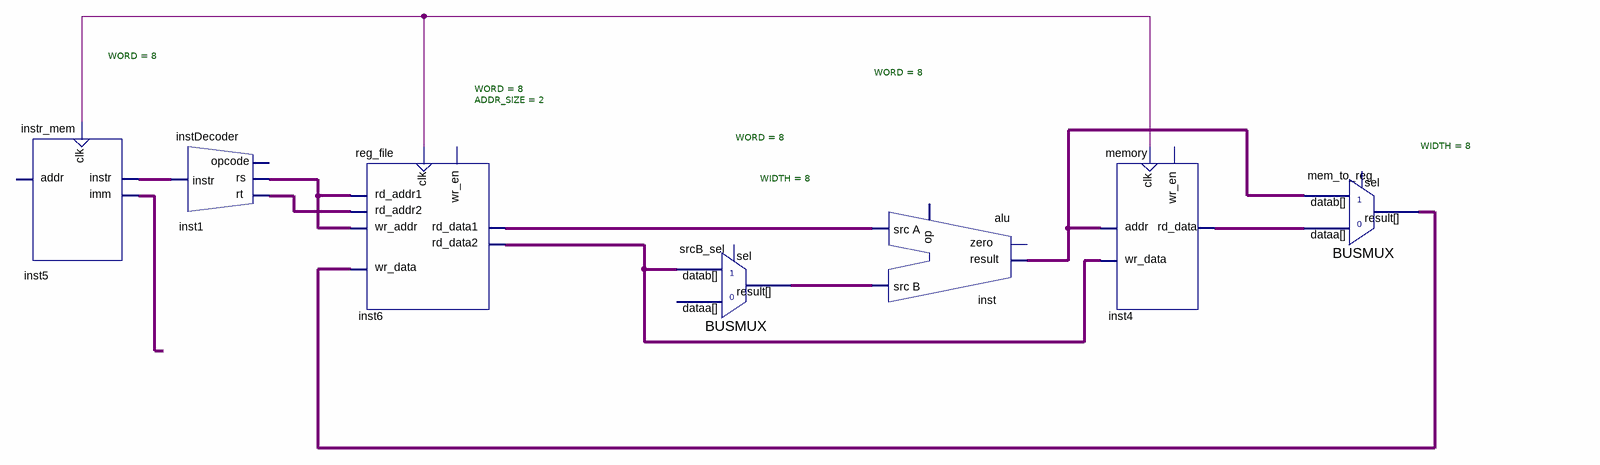
[diagram p0: schematic sheet]
// Quartus schematic cpu_block.bdf as structural Verilog: 7 symbols, 0 pins
module cpu_block (
);

  wire inst1_rs, inst1_rt, inst5_imm, inst5_instr, inst6_rd_data1, undriven;
  wire [7:0] inst4_rd_data, inst6_rd_data2, inst_result, mem_to_reg_result, srcB_sel_result;

  instr_mem #(.WORD(8)) inst5 (.clk(undriven), .instr(inst5_instr), .imm(inst5_imm));  // open: addr
  instDecoder inst1 (.instr(inst5_instr), .rs(inst1_rs), .rt(inst1_rt));  // open: opcode
  reg_file #(.WORD(8), .ADDR_SIZE(2)) inst6 (
    .clk(undriven), .rd_addr1(inst1_rs), .rd_addr2(inst1_rt), .wr_addr(inst1_rs),
    .wr_data(mem_to_reg_result), .rd_data2(inst6_rd_data2), .rd_data1(inst6_rd_data1));  // open: wr_en
  BUSMUX #(.WIDTH(8)) srcB_sel (.datab(inst6_rd_data2), .result(srcB_sel_result));  // open: sel, dataa
  alu #(.WORD(8)) inst (.\src_A (inst6_rd_data1), .\src_B (srcB_sel_result), .result(inst_result));  // open: op, zero
  memory #(.WORD(8)) inst4 (
    .clk(undriven), .addr(inst_result), .wr_data(inst6_rd_data2), .rd_data(inst4_rd_data));  // open: wr_en
  BUSMUX #(.WIDTH(8)) mem_to_reg (.datab(inst_result), .dataa(inst4_rd_data), .result(mem_to_reg_result));  // open: sel
endmodule
